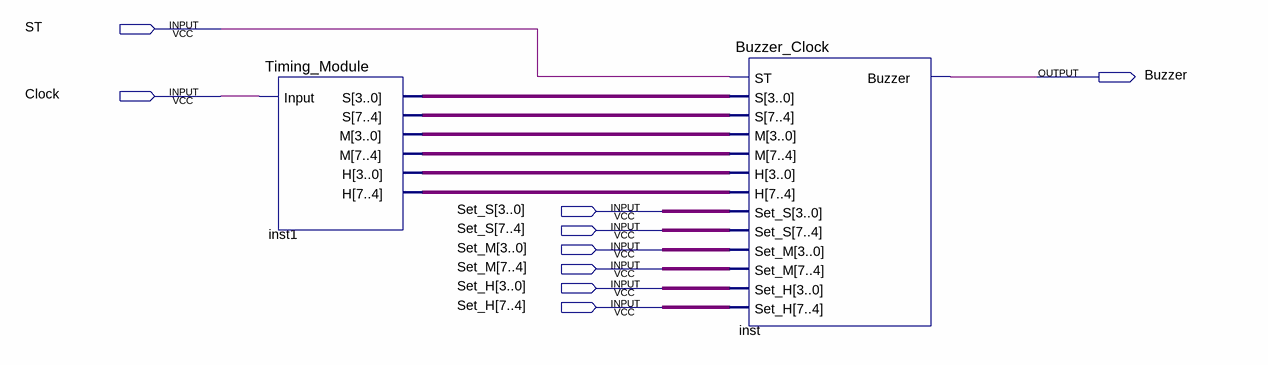
[diagram p0: schematic sheet]
// Quartus schematic Buzzer_Clock_Simulation.bdf as structural Verilog: 2 symbols, 9 pins
module Buzzer_Clock_Simulation (
  input  ST,
  input  Clock,
  input  [7:0] Set_S,
  input  [7:0] Set_M,
  input  [7:0] Set_H,
  output Buzzer
);

  wire [3:0] inst1_h, inst1_h_2, inst1_m, inst1_m_2, inst1_s, inst1_s_2;

  Timing_Module inst1 (.Input(Clock), .S({inst1_s_2, inst1_s}), .M({inst1_m_2, inst1_m}), .H({inst1_h_2, inst1_h}));
  Buzzer_Clock inst (
    .ST(ST), .S({inst1_s_2, inst1_s}), .M({inst1_m_2, inst1_m}), .H({inst1_h_2, inst1_h}), .Set_S(Set_S),
    .Set_M(Set_M), .Set_H(Set_H), .Buzzer(Buzzer));
endmodule
